# Altium schematic sheet FrontEnd_PS.SchDoc: FMC SDR Frontend
size 420 x 297 mm; CheckedBy: -; CompanyName: CERN; DrawnBy: DrawnBy; Organization: CERN; Address1: European Organization for Nuclear Research; Address2: CH-1211 Genčve 23 - Switzerland; Revision: -; SheetNumber: -; SheetTotal: -; EDA_Number: EDA-XXXXX-VX-X; Projet: -; ModifiedBy: -; CreateDate: XX/XX/XXXX; CheckedDate: -; Title2: Power Supply Top sheet; DivGrp: TE/MPE; Designer: Designer; ModifiedDate: -
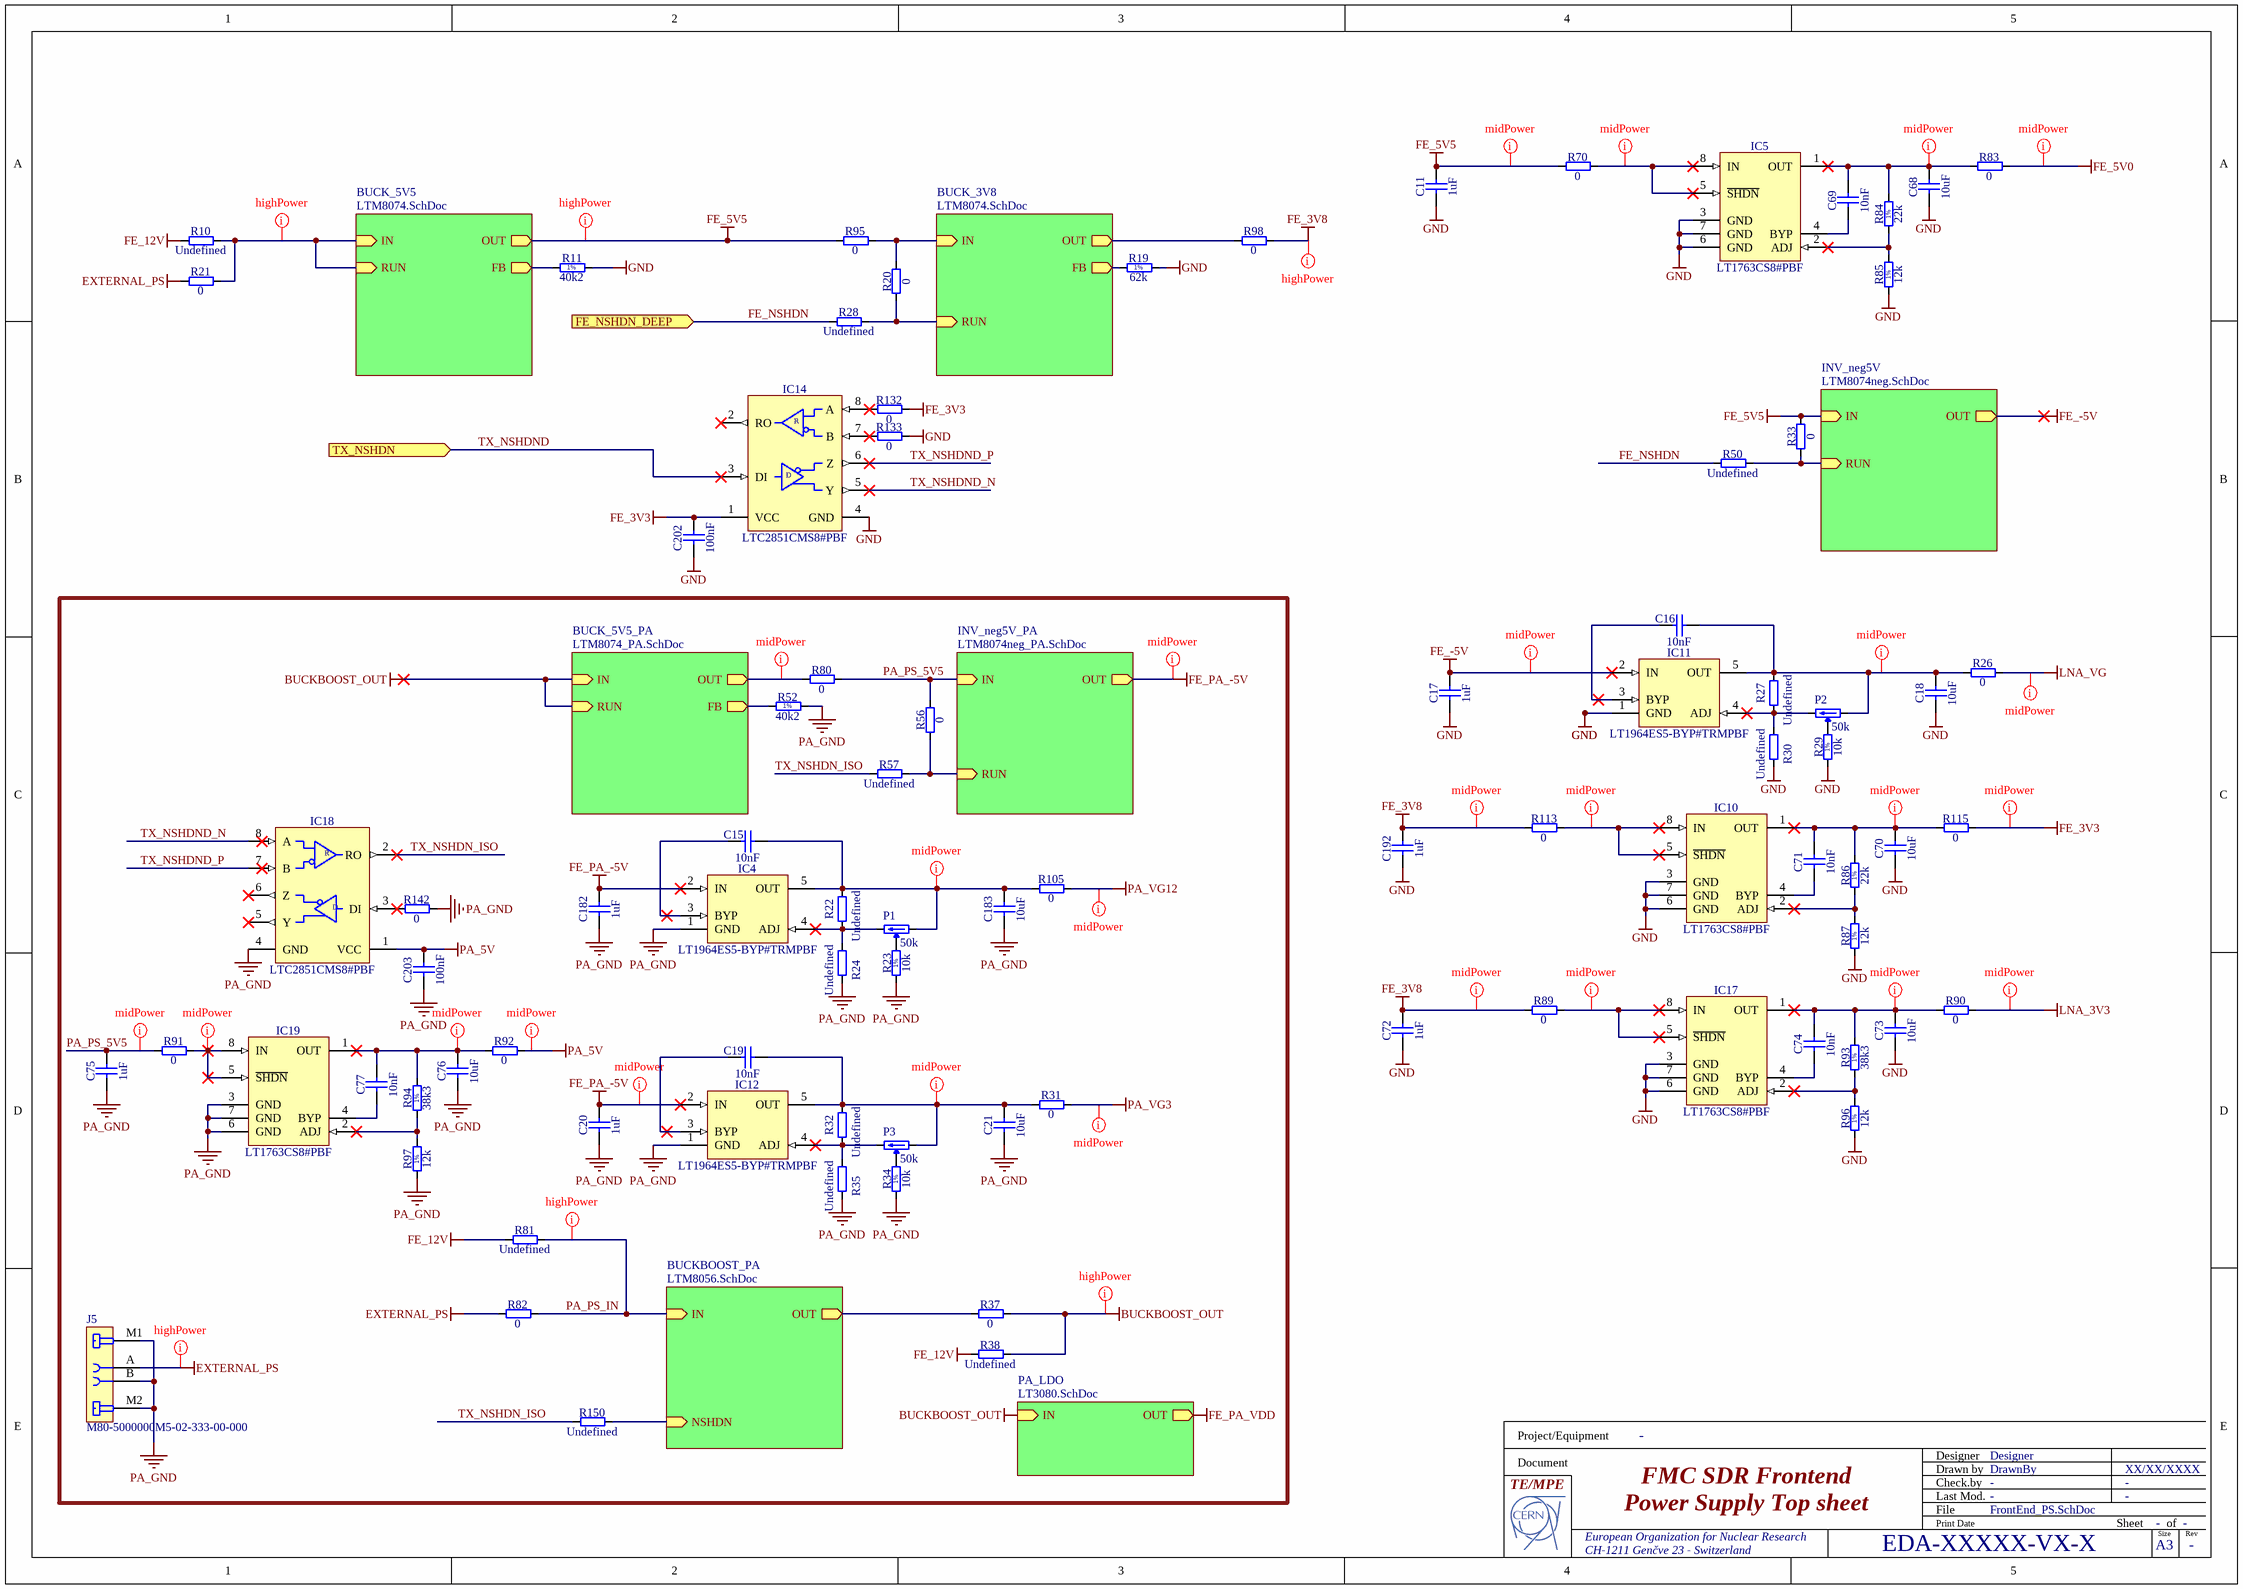
[diagram p0: FrontEnd_PS.SchDoc]

## Parts
C11  1uF  [CAPC1608X87N]
C15  10nF  [CAPC1608X87N]
C16  10nF  [CAPC1608X87N]
C17  1uF  [CAPC1608X87N]
C18  10uF  [CAPC2012X95N]
C19  10nF  [CAPC1608X87N]
C20  1uF  [CAPC1608X87N]
C21  10uF  [CAPC2012X95N]
C68  10uF  [CAPC2012X95N]
C69  10nF  [CAPC1005X55N]
C70  10uF  [CAPC2012X95N]
C71  10nF  [CAPC1005X55N]
C72  1uF  [CAPC1608X87N]
C73  10uF  [CAPC2012X95N]
C74  10nF  [CAPC1005X55N]
C75  1uF  [CAPC1608X87N]
C76  10uF  [CAPC2012X95N]
C77  10nF  [CAPC1005X55N]
C182  1uF  [CAPC1608X87N]
C183  10uF  [CAPC2012X95N]
C192  1uF  [CAPC1608X87N]
C202  100nF  [CAPC1005X55N]
C203  100nF  [CAPC1005X55N]
IC4  LT1964ES5-BYP#TRMPBF  [SOT95P280X100-5N]
IC5  LT1763CS8#PBF  [SOIC127P600X175-8N]
IC10  LT1763CS8#PBF  [SOIC127P600X175-8N]
IC11  LT1964ES5-BYP#TRMPBF  [SOT95P280X100-5N]
IC12  LT1964ES5-BYP#TRMPBF  [SOT95P280X100-5N]
IC14  LTC2851CMS8#PBF  [SOP65P490X110-8N]
IC17  LT1763CS8#PBF  [SOIC127P600X175-8N]
IC18  LTC2851CMS8#PBF  [SOP65P490X110-8N]
IC19  LT1763CS8#PBF  [SOIC127P600X175-8N]
J5  M80-5000000M5-02-333-00-000  [M80-5000000M5-02-333-00-000]
P1  50k  [TRIM_BOURNS_3223W]
P2  50k  [TRIM_BOURNS_3223W]
P3  50k  [TRIM_BOURNS_3223W]
R10  Undefined  [RESC3216X65N]
R11  40k2  [RESC2012X60N]
R19  62k  [RESC2012X60N]
R20  0  [RESC1608X55N]
R21  0  [RESC3216X65N]
R22  Undefined  [RESC1608X55N]
R23  10k  [RESC1005X40N]
R24  Undefined  [RESC1608X55N]
R26  0  [RESC1608X55N]
R27  Undefined  [RESC1608X55N]
R28  Undefined  [RESC1608X55N]
R29  10k  [RESC1005X40N]
R30  Undefined  [RESC1608X55N]
R31  0  [RESC1608X55N]
R32  Undefined  [RESC1608X55N]
R33  0  [RESC1608X55N]
R34  10k  [RESC1005X40N]
R35  Undefined  [RESC1608X55N]
R37  0  [RESC3216X65N]
R38  Undefined  [RESC3216X65N]
R50  Undefined  [RESC1608X55N]
R52  40k2  [RESC2012X60N]
R56  0  [RESC1608X55N]
R57  Undefined  [RESC1608X55N]
R70  0  [RESC1608X55N]
R80  0  [RESC3216X65N]
R81  Undefined  [RESC3216X65N]
R82  0  [RESC3216X65N]
R83  0  [RESC1608X55N]
R84  22k  [RESC1005X40N]
R85  12k  [RESC1005X40N]
R86  22k  [RESC1005X40N]
R87  12k  [RESC1005X40N]
R89  0  [RESC1608X55N]
R90  0  [RESC1608X55N]
R91  0  [RESC1608X55N]
R92  0  [RESC1608X55N]
R93  38k3  [RESC1005X40N]
R94  38k3  [RESC1005X40N]
R95  0  [RESC3216X65N]
R96  12k  [RESC1005X40N]
R97  12k  [RESC1005X40N]
R98  0  [RESC3216X65N]
R105  0  [RESC1608X55N]
R113  0  [RESC1608X55N]
R115  0  [RESC1608X55N]
R132  0  [RESC1608X55N]
R133  0  [RESC1608X55N]
R142  0  [RESC1608X55N]
R150  Undefined  [RESC1608X55N]

## Sub-sheets
BUCK_3V8 = LTM8074.SchDoc: IN (in), OUT (out), FB (out), RUN (in)
BUCK_5V5 = LTM8074.SchDoc: IN (in), OUT (out), FB (out), RUN (in)
BUCK_5V5_PA = LTM8074_PA.SchDoc: IN (in), OUT (out), FB (out), RUN (in)
BUCKBOOST_PA = LTM8056.SchDoc: IN (in), OUT (out), NSHDN (in)
INV_neg5V = LTM8074neg.SchDoc: IN (in), OUT (out), RUN (in)
INV_neg5V_PA = LTM8074neg_PA.SchDoc: IN (in), OUT (out), RUN (in)
PA_LDO = LT3080.SchDoc: IN (in), OUT (out)

## Ports
FE_NSHDN_DEEP (in), TX_NSHDN (in)

## Nets
BUCKBOOST_OUT: R37.2 R38.2 ; sheet BUCK_5V5_PA/IN, sheet BUCK_5V5_PA/RUN, sheet PA_LDO/IN
EXTERNAL_PS: J5.A R21.1 R82.1
FE_3V3: C202.2 IC14.1(VCC) R115.2 R132.2
FE_3V8: C72.2 C192.2 R89.1 R98.2 R113.1
FE_5V0: R83.2
FE_5V5: C11.2 R33.2 R70.1 R95.1 ; sheet INV_neg5V/IN, sheet BUCK_5V5/OUT
FE_12V: R10.1 R38.1 R81.1
FE_-5V: C17.2 IC11.2(IN) ; sheet INV_neg5V/OUT
FE_PA_-5V: C20.2 C182.2 IC4.2(IN) IC12.2(IN) ; sheet INV_neg5V_PA/OUT
FE_PA_VDD: sheet PA_LDO/OUT
GND: C11.1 C17.1 C18.1 C68.1 C70.1 C72.1 C73.1 C192.1 C202.1 IC5.3(GND) IC5.6(GND) IC5.7(GND) IC10.3(GND) IC10.6(GND) IC10.7(GND) IC11.1(GND) IC14.4(GND) IC17.3(GND) IC17.6(GND) IC17.7(GND) R11.2 R19.2 R29.1 R30.1 R85.1 R87.1 R96.1 R133.2
LNA_3V3: R90.2
LNA_VG: R26.2
PA_5V: C203.2 IC18.1(VCC) R92.2
PA_GND: C20.1 C21.1 C75.1 C76.1 C182.1 C183.1 C203.1 IC4.1(GND) IC12.1(GND) IC18.4(GND) IC19.3(GND) IC19.6(GND) IC19.7(GND) J5.B J5.M1 J5.M2 R23.1 R24.1 R34.1 R35.1 R52.2 R97.1 R142.2
PA_VG3: R31.2
PA_VG12: R105.2
FE_NSHDN: R28.1 R50.1 ; port FE_NSHDN_DEEP
PA_PS_5V5: C75.2 R56.2 R80.2 R91.1 ; sheet INV_neg5V_PA/IN
PA_PS_IN: R81.2 R82.2 ; sheet BUCKBOOST_PA/IN
TX_NSHDN_ISO: IC18.2(RO) R57.1 R150.1
TX_NSHDND: IC14.3(DI) ; port TX_NSHDN
TX_NSHDND_N: IC14.5(Y) IC18.8(A)
TX_NSHDND_P: IC14.6(Z) IC18.7(B)
NetC15_1: C15.1 IC4.3(BYP)
NetC15_2: C15.2 C183.2 IC4.5(OUT) P1.1(CCW) R22.2 R105.1
NetC16_1: C16.1 IC11.3(BYP)
NetC16_2: C16.2 C18.2 IC11.5(OUT) P2.1(CCW) R26.1 R27.2
NetC19_1: C19.1 IC12.3(BYP)
NetC19_2: C19.2 C21.2 IC12.5(OUT) P3.1(CCW) R31.1 R32.2
NetC68_2: C68.2 C69.2 IC5.1(OUT) R83.1 R84.2
NetC69_1: C69.1 IC5.4(BYP)
NetC70_2: C70.2 C71.2 IC10.1(OUT) R86.2 R115.1
NetC71_1: C71.1 IC10.4(BYP)
NetC73_2: C73.2 C74.2 IC17.1(OUT) R90.1 R93.2
NetC74_1: C74.1 IC17.4(BYP)
NetC76_2: C76.2 C77.2 IC19.1(OUT) R92.1 R94.2
NetC77_1: C77.1 IC19.4(BYP)
NetIC4_4: IC4.4(ADJ) P1.3(CW) R22.1 R24.2
NetIC5_2: IC5.2(ADJ) R84.1 R85.2
NetIC5_5: IC5.5(~{SHDN}) IC5.8(IN) R70.2
NetIC10_2: IC10.2(ADJ) R86.1 R87.2
NetIC10_5: IC10.5(~{SHDN}) IC10.8(IN) R113.2
NetIC11_4: IC11.4(ADJ) P2.3(CW) R27.1 R30.2
NetIC12_4: IC12.4(ADJ) P3.3(CW) R32.1 R35.2
NetIC14_7: IC14.7(B) R133.1
NetIC14_8: IC14.8(A) R132.1
NetIC17_2: IC17.2(ADJ) R93.1 R96.2
NetIC17_5: IC17.5(~{SHDN}) IC17.8(IN) R89.2
NetIC18_3: IC18.3(DI) R142.1
NetIC19_2: IC19.2(ADJ) R94.1 R97.2
NetIC19_5: IC19.5(~{SHDN}) IC19.8(IN) R91.2
NetP1_2: P1.2(W) R23.2
NetP2_2: P2.2(W) R29.2
NetP3_2: P3.2(W) R34.2
NetR10_2: R10.2 R21.2 ; sheet BUCK_5V5/IN, sheet BUCK_5V5/RUN
NetR11_1: R11.1 ; sheet BUCK_5V5/FB
NetR19_1: R19.1 ; sheet BUCK_3V8/FB
NetR20_1: R20.1 R28.2 ; sheet BUCK_3V8/RUN
NetR20_2: R20.2 R95.2 ; sheet BUCK_3V8/IN
NetR33_1: R33.1 R50.2 ; sheet INV_neg5V/RUN
NetR37_1: R37.1 ; sheet BUCKBOOST_PA/OUT
NetR52_1: R52.1 ; sheet BUCK_5V5_PA/FB
NetR56_1: R56.1 R57.2 ; sheet INV_neg5V_PA/RUN
NetR80_1: R80.1 ; sheet BUCK_5V5_PA/OUT
NetR98_1: R98.1 ; sheet BUCK_3V8/OUT
NetR150_2: R150.2 ; sheet BUCKBOOST_PA/NSHDN

Not connected (* = marked no-connect by the designer): IC14 2(RO)*; IC18 5(Y)* 6(Z)*

## Layout directives
net class midPower: FE_3V3, FE_3V8, FE_5V0, FE_5V5, FE_-5V, FE_PA_-5V, LNA_3V3, LNA_VG, NetC15_2, NetC16_2, NetC19_2, NetC68_2, NetC70_2, NetC73_2, NetC76_2, NetIC5_5, NetIC10_5, NetIC17_5, NetIC19_5, NetR80_1, PA_5V, PA_PS_5V5, PA_VG3, PA_VG12
net class highPower: BUCKBOOST_OUT, EXTERNAL_PS, FE_3V8, FE_5V5, NetR10_2, PA_PS_IN

## Notes on the sheet
- (near R26) Starting from -4.5V
- (near R105) Starting from -4.5V
- (near R31) Starting from -4.5V
- (near R37) Now 20V.
- Project/Equipment
- Document
- Designer
- Drawn by
- Check.by
- File
- Last Mod.
- Print Date
- Sheet
- Size
- A3
- of
- Rev
- (in symbol LTC2851CMS8#PBF) R; D
- (in symbol R0402_10K_1%_0.0625W_100PPM) 1%
- (in symbol R0402_12K_1%_0.0625W_100PPM) 1%
- (in symbol R0402_22K_1%_0.0625W_100PPM) 1%
- (in symbol R0402_38K3_1%_0.0625W_100PPM) 1%
- (in symbol R0805_40K2_1%_0.125W_100PPM) 1%
- (in symbol R0805_62K_1%_0.125W_100PPM) 1%

## Library data of the parts
C11 C17 C20 C72 C75 C182 C192 = CC0603_1UF_25V_10%_X7R: Non-polarised capacitor; Part Description: SMD Multilayer Chip Ceramic Capacitor; Manufacturer: GENERIC; Manufacturer1 Part Number: GRM188R71E105KA12D; Voltage: 25V; TC: X7R; Tolerance: ±10%; Part Number: CC0603_1UF_25V_10%_X7R; Component Kind: Standard; Component Type: Standard; Pin Count: 2; Value: 1uF; Status: None; Manufacturer Part Number: CC0603_1UF_25V_10%_X7R; Case: 0603; Mounted: Yes; Socket: No; SMD: Yes; Sense: No; Manufacturer1 Example: MURATA; Manufacturer1 ComponentHeight: 0.9mm; HelpURL: \\cern.ch\dfs\Applications\Altium\Datasheets\CC0603_X7R_MURATA.pdf; Author: CERN DEM JLC; CreateDate: 18/01/2011; LatestRevisionDate: 18/01/2011
C15 C16 C19 = CC0603_10NF_50V_5%_C0G: Non-polarised capacitor; Part Description: SMD Multilayer Chip Ceramic Capacitor; Manufacturer: GENERIC; Manufacturer1 Part Number: C1608C0G1H103J080AA; Voltage: 50V; TC: C0G/NP0; Tolerance: ±5%; Part Number: CC0603_10NF_50V_5%_C0G; Component Kind: Standard; Component Type: Standard; Pin Count: 2; Value: 10nF; Status: Preferred; Manufacturer Part Number: CC0603_10NF_50V_5%_C0G; Case: 0603; Mounted: Yes; Socket: No; SMD: Yes; Sense: No; Manufacturer1 Example: TDK; Manufacturer1 ComponentHeight: 0.9mm; HelpURL: \\cern.ch\dfs\Applications\Altium\Datasheets\CC0603_C0G_TDK_C.pdf; Author: CERN DEM JLC; CreateDate: 10.12.2014; LatestRevisionDate: 10.12.2014
C18 C21 C68 C70 C73 C76 C183 = CC0805_10UF_25V_10%_X5R: Non-polarised capacitor; Part Description: SMD Multilayer Chip Ceramic Capacitor; Manufacturer: GENERIC; Manufacturer1 Part Number: GRM219R61E106KA12D; Voltage: 25V; TC: X5R; Tolerance: ±10%; Part Number: CC0805_10UF_25V_10%_X5R; Component Kind: Standard; Component Type: Standard; Pin Count: 2; Value: 10uF; Status: Preferred; Manufacturer Part Number: CC0805_10UF_25V_10%_X5R; Case: 0805; Mounted: Yes; Socket: No; SMD: Yes; Sense: No; Manufacturer1 Example: MURATA; Manufacturer1 ComponentHeight: 0.95mm; HelpURL: \\cern.ch\dfs\Applications\Altium\Datasheets\CC0805_X5R_MURATA_GRM.pdf; Author: CERN DEM JLC; CreateDate: 25/10/2012; LatestRevisionDate: 06/09/2016
C69 C71 C74 C77 = CC0402_10NF_50V_10%_X7R: Non-polarised capacitor; Part Description: SMD Multilayer Chip Ceramic Capacitor; Manufacturer: GENERIC; Manufacturer1 Part Number: GRM155R71H103KA88D; Voltage: 50V; TC: X7R; Tolerance: ±10%; Part Number: CC0402_10NF_50V_10%_X7R; Component Kind: Standard; Component Type: Standard; Pin Count: 2; Value: 10nF; Status: None; Manufacturer Part Number: CC0402_10NF_50V_10%_X7R; Case: 0402; Mounted: Yes; Socket: No; SMD: Yes; Sense: No; Manufacturer1 Example: MURATA; Manufacturer1 ComponentHeight: 0.55mm; HelpURL: \\cern.ch\dfs\Applications\Altium\Datasheets\CC0402_X7R_MURATA_GRM.pdf; Author: CERN DEM MR; CreateDate: 08.01.2016; LatestRevisionDate: 08.01.2016
C202 C203 = CC0402_100NF_16V_10%_X7R: Non-polarised capacitor; Part Description: SMD Multilayer Chip Ceramic Capacitor; Manufacturer: GENERIC; Manufacturer1 Part Number: GRM155R71C104KA88D; Voltage: 16V; TC: X7R; Tolerance: ±10%; Part Number: CC0402_100NF_16V_10%_X7R; Component Kind: Standard; Component Type: Standard; Pin Count: 2; Value: 100nF; Status: Not Recommended; Manufacturer Part Number: CC0402_100NF_16V_10%_X7R; Case: 0402; Mounted: Yes; Socket: No; SMD: Yes; Sense: No; Manufacturer1 Example: MURATA; Manufacturer1 ComponentHeight: 0.55mm; HelpURL: \\cern.ch\dfs\Applications\Altium\Datasheets\CC0402_X7R_MURATA_GRM.pdf; Author: CERN DEM JLC; CreateDate: 05.12.2013; LatestRevisionDate: 03.12.2007
IC4 IC11 IC12 = LT1964ES5-BYP#TRMPBF: 200mA, Low Noise, Low Dropout Negative Micropower Regulator; Part Description: -1.22V to -20V, 200mA, Low Noise, Low Dropout Negative Micropower Regulator; Manufacturer: LINEAR TECHNOLOGY; PressFit: No; Bonding: No; Part Number: LT1964ES5-BYP#TRMPBF; Component Kind: Standard; Component Type: Standard; Device: LT1964ES5-BYP#TRMPBF; PackageDescription: SOT23, 0.95mm pitch; 5 pin, 1.75mm W X 3.00mm L, IPC Medium Density; Manufacturer Part Number: LT1964ES5-BYP#TRMPBF; Pin Count: 5; Case: SOT23-5; Mounted: Yes; Socket: No; SMD: Yes; Sense: No; ComponentHeight: 1mm; HelpURL: \\cern.ch\dfs\Applications\Altium\Datasheets\LT1964ES5-BYP#TRMPBF.pdf; Author: CERN DEM MR; CreateDate: 17.02.2016; LatestRevisionDate: 17.02.2016
IC5 IC10 IC17 IC19 = LT1763CS8#PBF: 1.22V to 20V 500mA, Low Noise, LDO Adjustable Micropower Regulator; Manufacturer: LINEAR TECHNOLOGY; PressFit: No; Bonding: No; Part Number: LT1763CS8#PBF; Component Kind: Standard; Component Type: Standard; Device: LT1763CS8#PBF; PackageDescription: SOIC 8, Pitch 1.27mm, Body 4x5mm, IPC Medium Density; Part Description: 1.22V to 20V 500mA, Low Noise, LDO Adjustable Micropower Regulator; Manufacturer Part Number: LT1763CS8#PBF; Pin Count: 8; Case: SOIC8; Mounted: Yes; Socket: No; SMD: Yes; Sense: No; ComponentHeight: 1.75mm; HelpURL: \\cern.ch\dfs\Applications\Altium\Datasheets\LT1763CS8#PBF.pdf; Author: CERN DEM JLC; CreateDate: 11.01.2010; LatestRevisionDate: 11.01.2010
IC14 IC18 = LTC2851CMS8#PBF: 3.3V 20Mbps RS485/RS422 Transceivers; Manufacturer: LINEAR TECHNOLOGY; PressFit: No; Bonding: No; Part Number: LTC2851CMS8#PBF; Component Kind: Standard; Component Type: Standard; Device: LTC2851CMS8#PBF; PackageDescription: SOP, 0.65mm pitch; 8 pin, 3.00mm W X 3.00mm L X 1.10mm H body, IPC Medium Density; Part Description: 3.3V 20Mbps RS485/RS422 Transceivers; Manufacturer Part Number: LTC2851CMS8#PBF; Pin Count: 8; Case: MSOP8; Mounted: Yes; Socket: No; SMD: Yes; Sense: No; ComponentHeight: 1.1mm; HelpURL: \\cern.ch\dfs\Applications\Altium\Datasheets\LTC2851CMS8#PBF.pdf; Author: CERN DEM JLC; CreateDate: 14.12.2010; LatestRevisionDate: 14.12.2010
J5 = CON_M80-5000000M5-02-333-00-000: 2pin (2 power), THT socket with M2 jackscrews; Manufacturer: Harwin; Part Number: M80-5L10405M5-02-333-00-000; Bonding: No; ComponentHeigth: 6.05mm; PressFit: No; Case: M80-5000000M5-02-333-00-000; Component Kind: Standard; Component Type: Standard; CreateDate: 2018-06-18; Device: M80-5000000M5-02-333-00-000; HelpURL: https://www.harwin.com/products/M80-5000000M5-02-333-00-000/; LatestRevisionDate: 2018-06-18; Manufacturer Part Number: M80-5000000M5-02-333-00-000; Mounted: Yes; PackageDescription: H=6.05mm, W=18mm, D=8.6mm; Part Description: 2pin (2 power), THT socket with M2 jackscrews; Pin Count: 6; Sense: No; SMD: No; Socket: No; Value: *
P1-P3 = TRIM_11T_50K_BOURNS_3223W-1-503E: Trimming Potentiometer; Part Description: 11 Turns SMD Trimpot® Trimming Potentiometer (Top Adjust); Manufacturer: BOURNS; Power: 0.125W; TC: ±100ppm/°C; Tolerance: ±20%; PressFit: No; Part Number: TRIM_11T_50K_BOURNS_3223W-1-503E; Component Kind: Standard; Component Type: Standard; Pin Count: 3; Value: 50k; Manufacturer Part Number: 3223W-1-503E; Case: 3223W; Mounted: Yes; Socket: No; SMD: Yes; Sense: No; ComponentHeight: 4.16mm; HelpURL: \\cern.ch\dfs\Applications\Altium\Datasheets\TRIM_BOURNS_3223W.pdf; Author: CERN DEM JLC; CreateDate: 31.03.2011; LatestRevisionDate: 18.12.2012
R10 R38 R81 = R1206_NO-VALUE: Resistor; Part Description: Reserved Footprint For a 1206 (3216) Chip Resistor; PressFit: No; Mounted: No; Part Number: R1206_NO-VALUE; Component Kind: Standard; Component Type: Standard; Pin Count: 2; Value: Undefined; Status: None; Manufacturer: Undefined; Manufacturer Part Number: R1206_NO-VALUE; Case: 1206; Sense: No; Socket: No; SMD: Yes; Manufacturer1 Example: Undefined; Manufacturer1 Part Number: Undefined; Manufacturer1 ComponentHeight: 0.65mm; HelpURL: Undefined; Author: CERN DEM JLC; CreateDate: 03.12.2007; LatestRevisionDate: 13.03.2008
R11 R52 = R0805_40K2_1%_0.125W_100PPM: Resistor - 1%; Part Description: Thick Film Chip Resistor; Manufacturer: VISHAY; Manufacturer1 Part Number: CRCW080540K2FKEA; Power: 0.125W; TC: ±100ppm/°C; PressFit: No; Part Number: R0805_40K2_1%_0.125W_100PPM; Component Kind: Standard; Component Type: Standard; Pin Count: 2; Value: 40k2; Status: None; Tolerance: ±1%; Manufacturer Part Number: R0805_40K2_1%_0.125W_100PPM; Case: 0805; Mounted: Yes; Sense: No; Socket: No; SMD: Yes; Manufacturer1 Example: VISHAY; Manufacturer1 ComponentHeight: 0.6mm; HelpURL: \\cern.ch\dfs\Applications\Altium\Datasheets\R2512_VISHAY_CRCW0805.pdf; Author: CERN DEM JLC; CreateDate: 18.04.2013; LatestRevisionDate: 18.04.2013
R19 = R0805_62K_1%_0.125W_100PPM: Resistor - 1%; Part Description: General Purpose Thick Film Chip Resistor; Manufacturer: GENERIC; Manufacturer1 Part Number: NRC10F6202TRF; Power: 0.125W; TC: ±100ppm/°C; PressFit: No; Part Number: R0805_62K_1%_0.125W_100PPM; Component Kind: Standard; Component Type: Standard; Pin Count: 2; Value: 62k; Status: Preferred; Tolerance: ±1%; Manufacturer Part Number: R0805_62K_1%_0.125W_100PPM; Case: 0805; Mounted: Yes; Sense: No; Socket: No; SMD: Yes; Manufacturer1 Example: NIC COMPONENT; Manufacturer1 ComponentHeight: 0.6mm; HelpURL: \\cern.ch\dfs\Applications\Altium\Datasheets\R0805_NIC_NRC.pdf; Author: CERN DEM JLC; CreateDate: 03.12.2007; LatestRevisionDate: 13.03.2008
R20 R26 R31 R33 R56 R70 R83 R89-R92 R105 R113 R115 R132 R133 R142 = R0603_0R_JUMPER: Resistor; Part Description: 1A (0.05R Max DC Resistance) Zero Ohm Jumper; Manufacturer: GENERIC; Manufacturer1 Part Number: NRC06Z0; PressFit: No; Part Number: R0603_0R_JUMPER; Component Kind: Standard; Component Type: Standard; Pin Count: 2; Value: 0; Status: Preferred; Manufacturer Part Number: R0603_0R_JUMPER; Case: 0603; Mounted: Yes; Sense: No; Socket: No; SMD: Yes; Manufacturer1 Example: NIC COMPONENT; Manufacturer1 ComponentHeight: 0.55mm; HelpURL: \\cern.ch\dfs\Applications\Altium\Datasheets\R0603_NIC_NRC.pdf; Author: CERN DEM JLC; CreateDate: 03.12.2007; LatestRevisionDate: 13.03.2008
R21 R37 R80 R82 R95 R98 = R1206_0R_JUMPER: Resistor; Part Description: 2A (0.05R Max DC Resistance) Zero Ohm Jumper; Manufacturer: GENERIC; Manufacturer1 Part Number: NRC12Z0; PressFit: No; Part Number: R1206_0R_JUMPER; Component Kind: Standard; Component Type: Standard; Pin Count: 2; Value: 0; Status: Preferred; Manufacturer Part Number: R1206_0R_JUMPER; Case: 1206; Mounted: Yes; Sense: No; Socket: No; SMD: Yes; Manufacturer1 Example: NIC COMPONENT; Manufacturer1 ComponentHeight: 0.65mm; HelpURL: \\cern.ch\dfs\Applications\Altium\Datasheets\R1206_NIC_NRC.pdf; Author: CERN DEM JLC; CreateDate: 03.12.2007; LatestRevisionDate: 13.03.2008
R22 R24 R27 R28 R30 R32 R35 R50 R57 R150 = R0603_NO-VALUE: Resistor; Part Description: Reserved Footprint For a 0603 (1608) Chip Resistor; PressFit: No; Mounted: No; Part Number: R0603_NO-VALUE; Component Kind: Standard; Component Type: Standard; Pin Count: 2; Value: Undefined; Status: None; Manufacturer: Undefined; Manufacturer Part Number: R0603_NO-VALUE; Case: 0603; Sense: No; Socket: No; SMD: Yes; Manufacturer1 Example: Undefined; Manufacturer1 Part Number: Undefined; Manufacturer1 ComponentHeight: Undefined; HelpURL: Undefined; Author: CERN DEM JLC; CreateDate: 03.12.2007; LatestRevisionDate: 13.03.2008
R23 R29 R34 = R0402_10K_1%_0.0625W_100PPM: Resistor - 1%; Part Description: General Purpose Thick Film Chip Resistor; Manufacturer: GENERIC; Manufacturer1 Part Number: 232270671003L; TC: ±100ppm/°C; PressFit: No; Part Number: R0402_10K_1%_0.0625W_100PPM; Component Kind: Standard; Component Type: Standard; Pin Count: 2; Value: 10k; Status: Not Recommended; Power: 0.0625W; Tolerance: ±1%; Manufacturer Part Number: R0402_10K_1%_0.0625W_100PPM; Case: 0402; Mounted: Yes; Sense: No; Socket: No; SMD: Yes; Manufacturer1 Example: YAGEO PHYCOMP; Manufacturer1 ComponentHeight: 0.4mm; HelpURL: \\cern.ch\dfs\Applications\Altium\Datasheets\R0402_Phycomp_RC0402.pdf; Author: CERN DEM JLC; CreateDate: 03.12.2007; LatestRevisionDate: 17.10.2012
R84 R86 = R0402_22K_1%_0.0625W_100PPM: Resistor - 1%; Part Description: General Purpose Thick Film Chip Resistor; Manufacturer: GENERIC; Manufacturer1 Part Number: 232270672203L; TC: ±100ppm/°C; PressFit: No; Part Number: R0402_22K_1%_0.0625W_100PPM; Component Kind: Standard; Component Type: Standard; Pin Count: 2; Value: 22k; Status: Not Recommended; Power: 0.0625W; Tolerance: ±1%; Manufacturer Part Number: R0402_22K_1%_0.0625W_100PPM; Case: 0402; Mounted: Yes; Sense: No; Socket: No; SMD: Yes; Manufacturer1 Example: YAGEO PHYCOMP; Manufacturer1 ComponentHeight: 0.4mm; HelpURL: \\cern.ch\dfs\Applications\Altium\Datasheets\R0402_Phycomp_RC0402.pdf; Author: CERN DEM JLC; CreateDate: 03.12.2007; LatestRevisionDate: 17.10.2012
R85 R87 R96 R97 = R0402_12K_1%_0.0625W_100PPM: Resistor - 1%; Part Description: General Purpose Thick Film Chip Resistor; Manufacturer: GENERIC; Manufacturer1 Part Number: 232270671203L; TC: ±100ppm/°C; PressFit: No; Part Number: R0402_12K_1%_0.0625W_100PPM; Component Kind: Standard; Component Type: Standard; Pin Count: 2; Value: 12k; Status: Not Recommended; Power: 0.0625W; Tolerance: ±1%; Manufacturer Part Number: R0402_12K_1%_0.0625W_100PPM; Case: 0402; Mounted: Yes; Sense: No; Socket: No; SMD: Yes; Manufacturer1 Example: YAGEO PHYCOMP; Manufacturer1 ComponentHeight: 0.4mm; HelpURL: \\cern.ch\dfs\Applications\Altium\Datasheets\R0402_Phycomp_RC0402.pdf; Author: CERN DEM JLC; CreateDate: 03.12.2007; LatestRevisionDate: 17.10.2012
R93 R94 = R0402_38K3_1%_0.0625W_100PPM: Resistor - 1%; Part Description: General Purpose Thick Film Chip Resistor; Manufacturer: GENERIC; Manufacturer1 Part Number: 232270673833L or RC0402FR-0738K3L; TC: ±100ppm/°C; PressFit: No; Part Number: R0402_38K3_1%_0.0625W_100PPM; Component Kind: Standard; Component Type: Standard; Pin Count: 2; Value: 38k3; Status: Not Recommended; Power: 0.0625W; Tolerance: ±1%; Manufacturer Part Number: R0402_38K3_1%_0.0625W_100PPM; Case: 0402; Mounted: Yes; Sense: No; Socket: No; SMD: Yes; Manufacturer1 Example: YAGEO PHYCOMP; Manufacturer1 ComponentHeight: 0.4mm; HelpURL: \\cern.ch\dfs\Applications\Altium\Datasheets\R0402_Phycomp_RC0402.pdf; Author: CERN DEM BC; CreateDate: 29.07.2015; LatestRevisionDate: 29.07.2015